# Altium schematic sheet SH10 - OMAP-L137 JTAG.SchDoc
size 386 x 246 mm
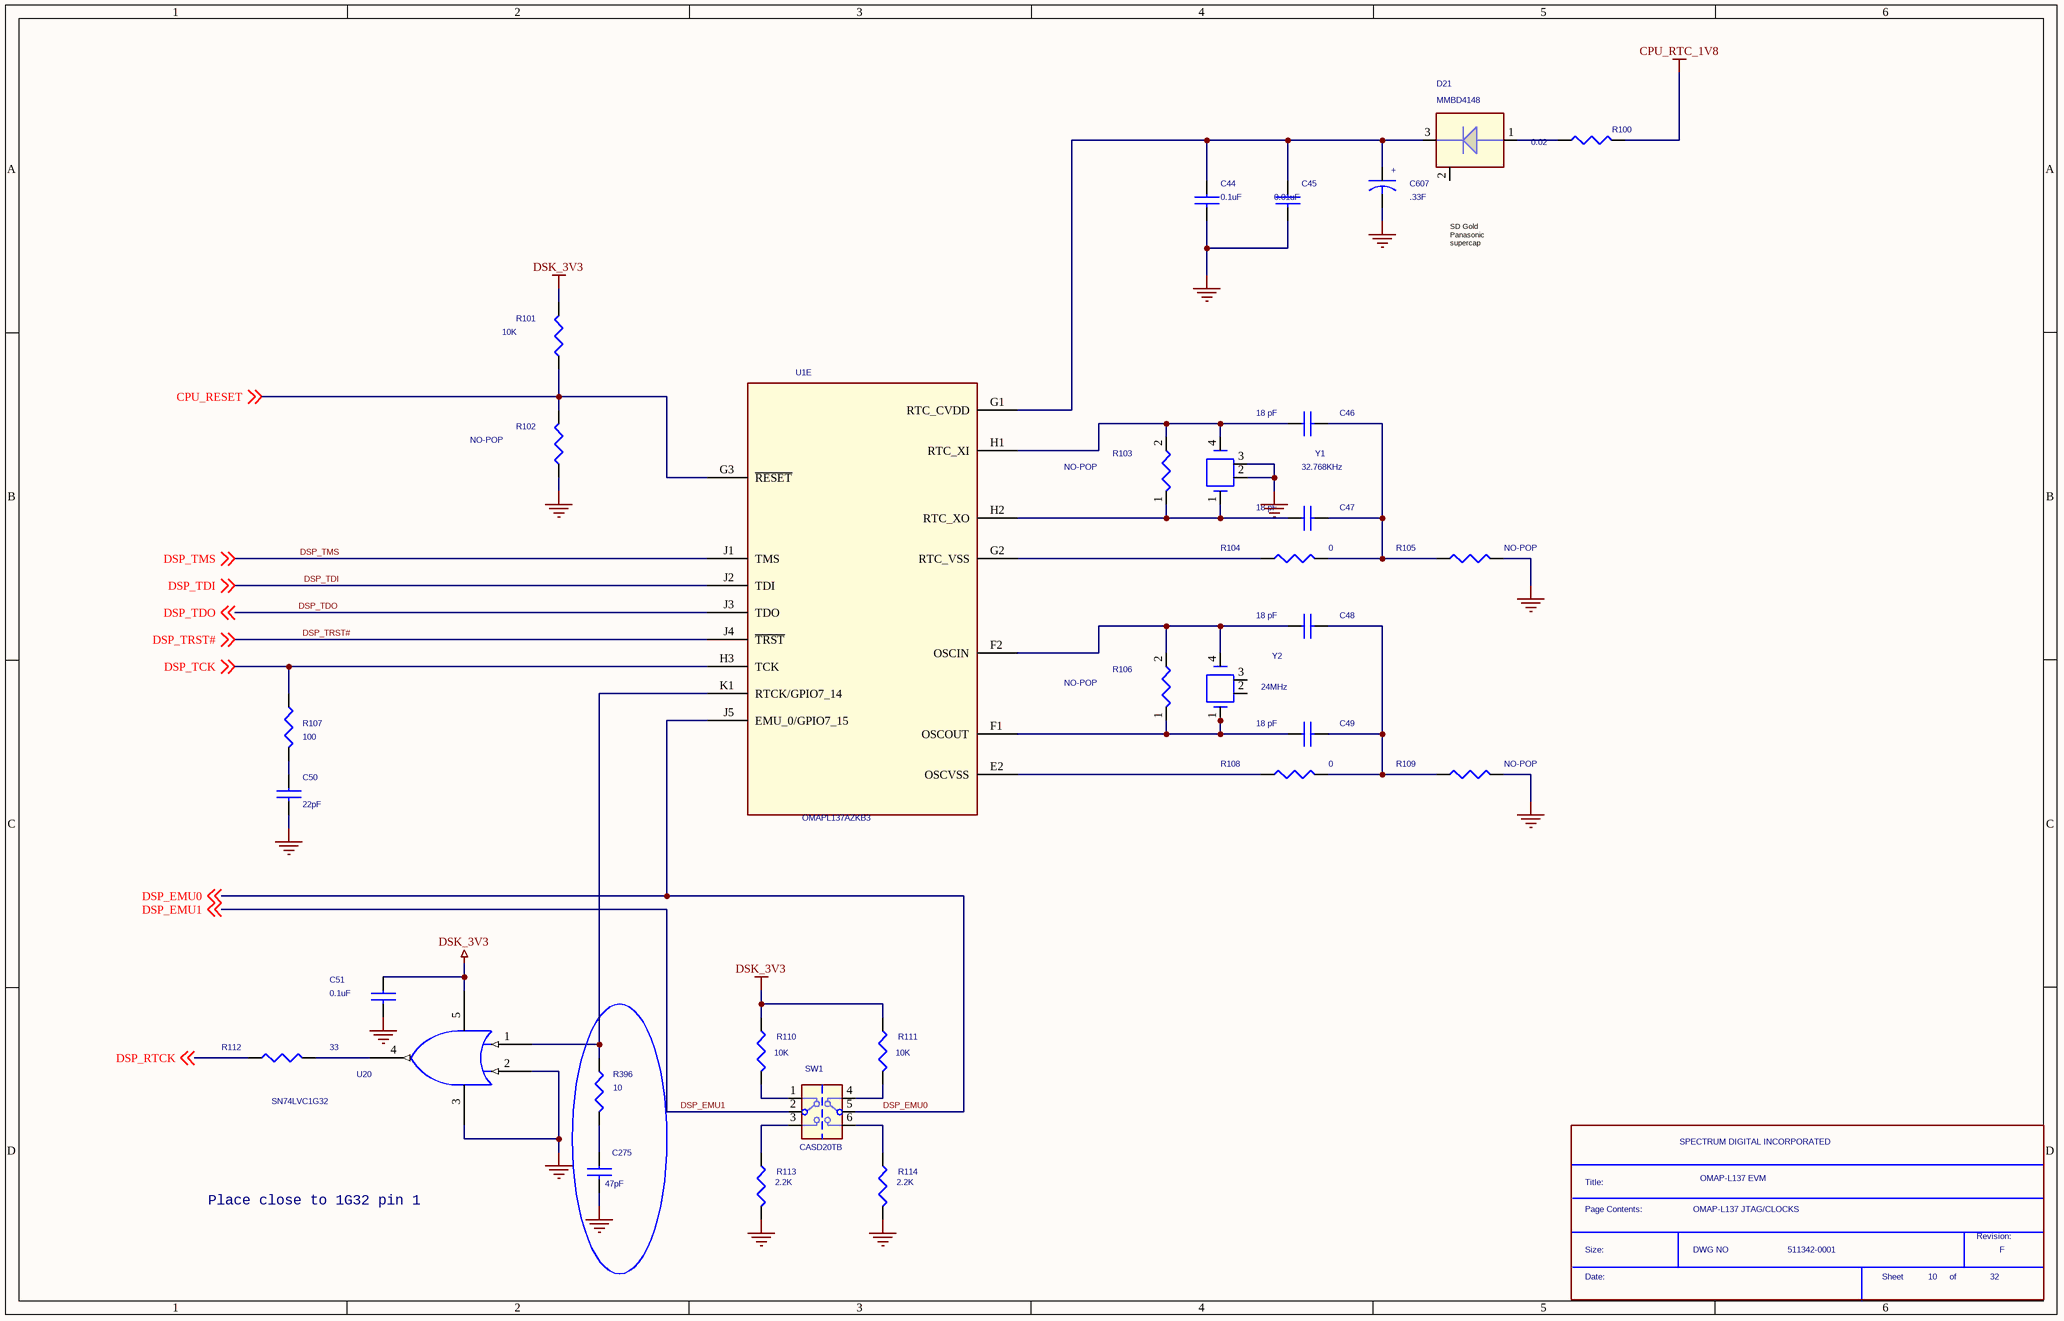
[diagram p0: SH10 - OMAP-L137 JTAG.SchDoc]

## Parts
*  Page Contents:: OMAP-L137 JTAG/CLOCKS  RevCode: F  Title: OMAP-L137 EVM  OrgName: SPECTRUM DIGITAL INCORPORATED  Doc: 511342-0001  Page Number: 10  Page Count: 32  (hidden comment: SDTitleBlock)  (graphical)
C44  0.1uF  [c402-25]
C45  0.01uF  [c402-25]
C46  18 pF  [c603-35x45]
C47  18 pF  [c603-35x45]
C48  18 pF  [c603-35x45]
C49  18 pF  [c603-35x45]
C50  22pF  [c603-35x45]
C51  0.1uF  [c402-25]
C275  47pF  [C0603]
C607  .33F  [EIA_D]
D21  MMBD4148  [SOT23-3]
R100  0.02  [r1206-40x70]
R101  10K  [r402-25]
R102  NO-POP  [r402-25]
R103  NO-POP  [r402-25]
R104  0  [r402-25]
R105  NO-POP  [r402-25]
R106  NO-POP  [r402-25]
R107  100  [r603-35x45]
R108  0  [r402-25]
R109  NO-POP  [r402-25]
R110  10K  [r402-25]
R111  10K  [r402-25]
R112  33  [r402-25]
R113  2.2K  [r402-25]
R114  2.2K  [r402-25]
R396  10  [r402-25]
SW1  CASD20TB  [sw6-40x67_gw]
U1  OMAPL137AZKB3  [skt256-6064]  (part E of 9)
U20  SN74LVC1G32  [SO5]
Y1  32.768KHz  [xtal4-23x47-ssp-t7]
Y2  24MHz  [xtal2-75x94]

## Nets
CPU_RTC_1V8: R100.1
DSK_3V3: C51.1 R101.1 R110.1 R111.1 U20.5(VCC)
GND: C44.2 C45.2 C50.2 C51.2 C275.2 C607.2 R102.2 R105.2 R109.2 R113.2 R114.2 U20.2(A) U20.3(GND) Y1.2 Y1.3
CPU_RESET: R101.2 R102.1 U1.G3(~{RESET}) ; off-sheet CPU_RESET
DSP_EMU0: SW1.5 U1.J5(EMU_0/GPIO7_15) ; off-sheet DSP_EMU0
DSP_EMU1: SW1.2 ; off-sheet DSP_EMU1
DSP_RTCK: R112.1 ; off-sheet DSP_RTCK
DSP_TCK: R107.1 U1.H3(TCK) ; off-sheet DSP_TCK
DSP_TDI: U1.J2(TDI) ; off-sheet DSP_TDI
DSP_TDO: U1.J3(TDO) ; off-sheet DSP_TDO
DSP_TMS: U1.J1(TMS) ; off-sheet DSP_TMS
DSP_TRST#: U1.J4(~{TRST}) ; off-sheet DSP_TRST#
NetC44_1: C44.1 C45.1 C607.1 D21.3(CATHODE) U1.G1(RTC_CVDD)
NetC46_1: C46.1 R103.2 U1.H1(RTC_XI) Y1.4
NetC46_2: C46.2 C47.2 R104.2 R105.1
NetC47_1: C47.1 R103.1 U1.H2(RTC_XO) Y1.1
NetC48_1: C48.1 R106.2 U1.F2(OSCIN) Y2.4
NetC48_2: C48.2 C49.2 R108.2 R109.1
NetC49_1: C49.1 R106.1 U1.F1(OSCOUT) Y2.1
NetC50_1: C50.1 R107.2
NetC275_1: C275.1 R396.2
NetD21_1: D21.1(ANODE) R100.2
NetR104_1: R104.1 U1.G2(RTC_VSS)
NetR108_1: R108.1 U1.E2(OSCVSS)
NetR110_2: R110.2 SW1.1
NetR111_2: R111.2 SW1.4
NetR112_2: R112.2 U20.4(Y)
NetR113_1: R113.1 SW1.3
NetR114_1: R114.1 SW1.6
NetR396_1: R396.1 U1.K1(RTCK/GPIO7_14) U20.1(B)

Not connected (* = marked no-connect by the designer): D21 2; Y2 2 3

## Notes on the sheet
- SD Gold
  Panasonic
  supercap
- Place close to 1G32 pin 1
- (in symbol CAP_0) +
- (in symbol SDTitleBlock) Title:; Page Contents:; Revision:; Size:; DWG NO; Date:; Sheet; of

## Library data of the parts
C44 C51 = CAP NP: Part #: 101587-1100R
C45 = CAP NP: Part #: 101587-1101R
C46-C49 = CAP NP_3: Part #: 101103-1184R; SD PCB Footprint: EIA0603
C50 = CAP NP_7: Part #: 101002-1224R
C275 = CAP .1 uF 10% 0603: Part #: 101782-1474R
C607 = CAP_0: .33F 5.5V Gold SD Horizontal Cap.; MfrNum: EEC-S0HD334H; Mfr: Panasonic; PartName: Cap .33F Gold SD 5.5V 20%; Part #: 101056-0335R; TI Footprint: RAD400-400C; Cost10K: 0.616; Cost100: 1.106; VendorNum: P11064-ND; Vendor: Digikey
D21 = MMBD4148_0: Part #: 100185-0001R
R100 = R: Part #: 102598-0002R
R101 R110 R111 = R: Part #: 101370-1003R
R102 = R: Part #: R0402-NOPOP
R103 R106 = R_2: Part #: R0402-NOPOP; SD PCB Footprint: EIA0603
R104 R108 = R: Part #: 101370-0001R; SD PCB Footprint: EIA0603
R105 R109 = R: Part #: R0402-NOPOP; SD PCB Footprint: EIA0603
R107 = R: Part #: 100642-1001R
R112 = R: Part #: 101370-3300R
R113 R114 = R: Part #: 101370-2202R
R396 = R: Part #: 101370-1000R
SW1 = SW - DPDT 5.4x4.2 Slide CAS220A: SLIDE Switch, DPDT,  100mA, J HOOK; MfrNum: CAS-220A; Mfr: BC Components; Part #: 102181-0002R; Vendor: Digi_Key; VendorNum: CAS220JCT-ND; SD PCB Footprint: CAS-220A
U1 = PRIMUS_BGA_1: Part #: 102772-0001; SWAP_INFO: (S1+S2+S3+S4+S5+S6+S7+S8+S9); SPLIT_INST: TRUE
U20 = 1G032: Part #: 101057-0032R
Y1 = CRYSTAL_0: Part #: 102883-0032R
Y2 = CRYSTAL_0: Part #: 101590-0240R; Spectrum Part#: 101590-0270; SD PCB Footprint: ABM7